# EAGLE schematic NSE2022_GPSDOWNLINK_ver0 (EAGLE 9.6.0)
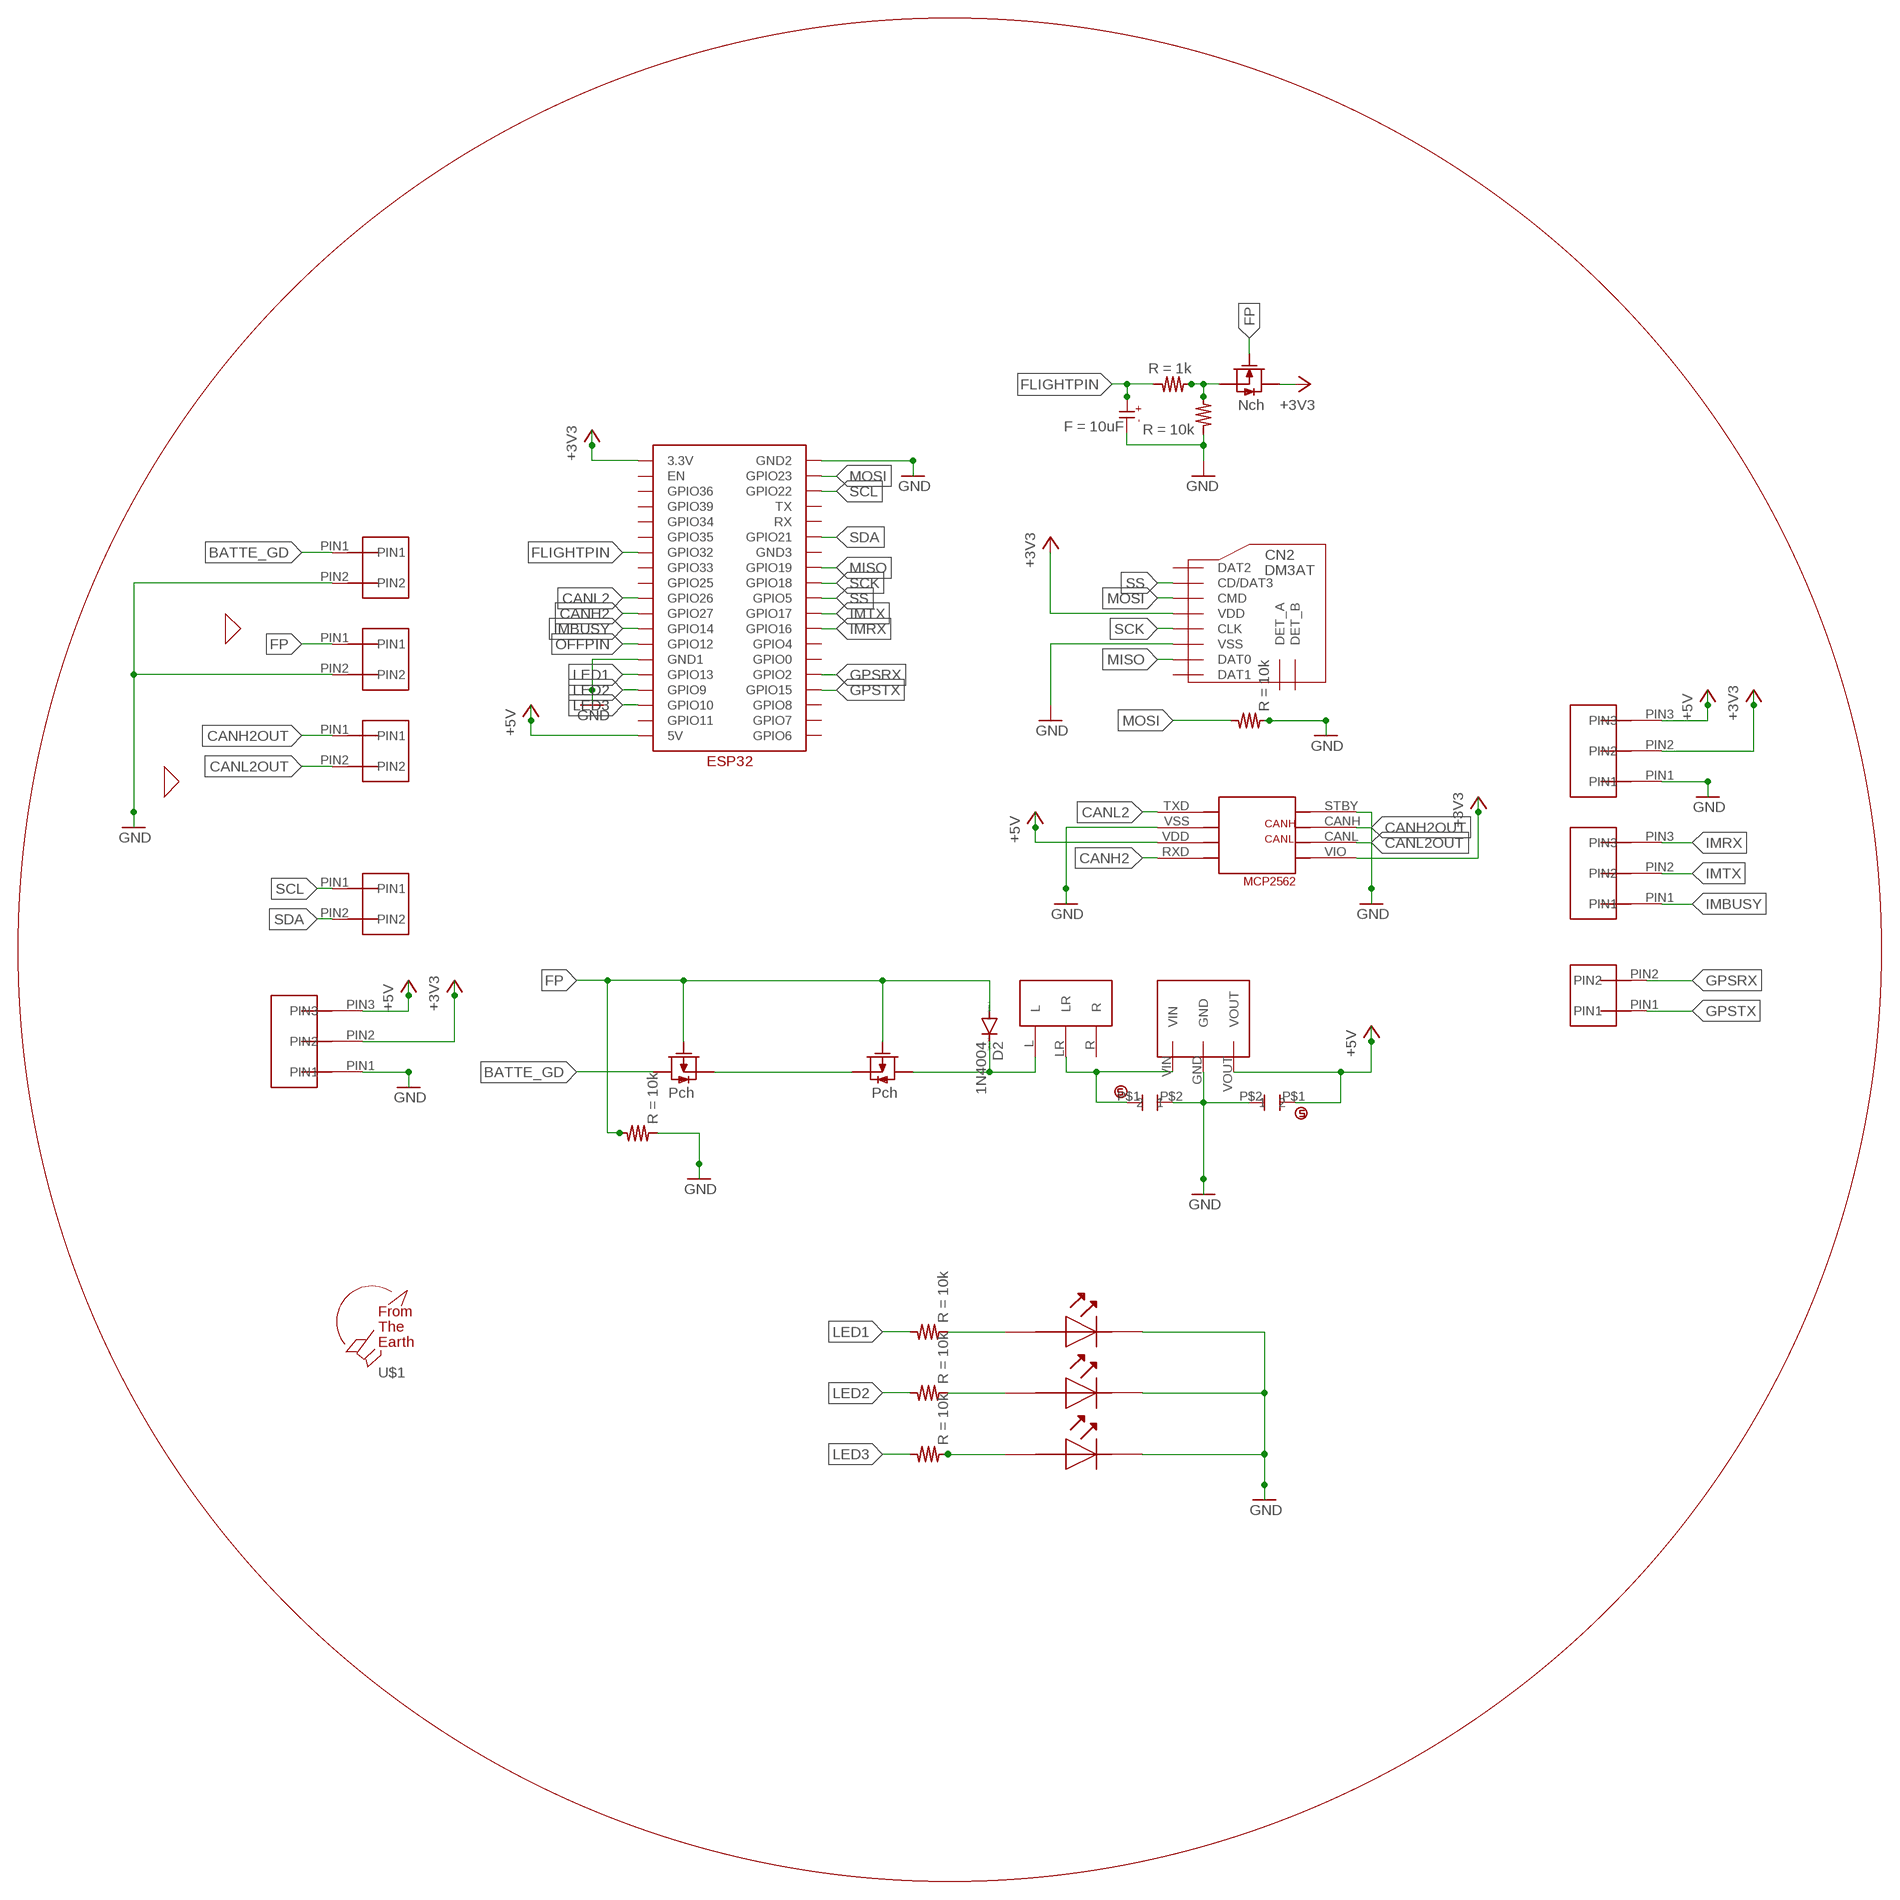
[diagram p0: schematic, sheet 1]

## Parts
10K  10K  RESISTER  [REGISTER]
C3  CAPACITOR-ELECTROLYTIC_1  [CAPACITOR-ELECTROLYTIC_1]
CERAMIC_CAPACITOR1  CERAMIC_CAPACITOR  [CERAMIC_CAPACITOR]
CERAMIC_CAPACITOR2  CERAMIC_CAPACITOR  [CERAMIC_CAPACITOR]
CN2  DM3AT  [DM3AT]
D2  1N4004  [DO41-10]
R1  RESISTER  [REGISTER]
R2  RESISTER  [REGISTER]
R3  RESISTER  [REGISTER]
R7  RESISTER  [REGISTER]
R8  RESISTER  [REGISTER]
R16  RESISTER  [REGISTER]
SRIDE_SWTCH3  SRIDE_SWITCH  [SRIDE_SWITCH]
U$1  F.T.E.LOGO  [LOGO]
U$2  2PIN  [2PIN]
U$3  2SJ681-PCH  [2SJ681]
U$4  3PIN  [3PIN]
U$5  2SJ681-PCH  [2SJ681]
U$6  M78AR05-1  [M78AR05-1]
U$7  2SK4017-NCH  [2SK4017]
U$22  2PIN  [2PIN]
U$23  2PIN  [2PIN]
U$24  2PIN  [2PIN]
U$26  ESP32  [ESP32]
U$28  MCP2562  [MCP2562]
U$29  2PIN  [2PIN]
U$46  3PIN  [3PIN]
U$49  3PIN  [3PIN]
U$55  LED  [LED]
U$70  LED  [LED]
U$71  LED  [LED]

## Nets
+3V3: CN2.VDD U$4.PIN2 U$7.DRAIN U$26.3.3V U$28.VIO U$46.PIN2
+5V: CERAMIC_CAPACITOR1.P$1 U$4.PIN3 U$6.VOUT U$26.5V U$28.VDD U$46.PIN3
BATTE_GD: U$5.DRAIN U$22.PIN1
CANH2: U$26.GPIO27 U$28.RXD
CANH2OUT: U$24.PIN1 U$28.CANH
CANL2: U$26.GPIO26 U$28.TXD
CANL2OUT: U$24.PIN2 U$28.CANL
FLIGHTPIN: C3.KS R8.A U$26.GPIO32
FP: D2.A R3.B U$3.GATE U$5.GATE U$7.GATE U$23.PIN1
GND: 10K.A C3.AN CERAMIC_CAPACITOR1.P$2 CERAMIC_CAPACITOR2.P$2 CN2.VSS R3.A R7.A U$4.PIN1 U$6.GND U$22.PIN2 U$23.PIN2 U$26.GND1 U$28.STBY U$28.VSS U$46.PIN1 U$55.PLUS(OUT) U$70.PLUS(OUT) U$71.PLUS(OUT)
GPSRX: U$26.GPIO2 U$29.PIN2
GPSTX: U$26.GPIO15 U$29.PIN1
IMBUSY: U$26.GPIO14 U$49.PIN1
IMRX: U$26.GPIO16 U$49.PIN3
IMTX: U$26.GPIO17 U$49.PIN2
LED1: R1.B U$26.GPIO13
LED2: R2.B U$26.GPIO9
LED3: R16.B U$26.GPIO10
MISO: CN2.DAT0 U$26.GPIO19
MOSI: 10K.B CN2.CMD U$26.GPIO23
N$1: U$26.GND2 ; supply symbol labelled GND
N$3: U$3.SOURCE U$5.SOURCE
N$4: CERAMIC_CAPACITOR2.P$1 SRIDE_SWTCH3.LR U$6.VIN
N$9: R7.B R8.B U$7.SOURCE
N$12: D2.C SRIDE_SWTCH3.L U$3.DRAIN
N$14: R1.A U$55.MINUS(IN)
N$18: R2.A U$70.MINUS(IN)
N$19: R16.A U$71.MINUS(IN)
OFFPIN: U$26.GPIO12
SCK: CN2.CLK U$26.GPIO18
SCL: U$2.PIN1 U$26.GPIO22
SDA: U$2.PIN2 U$26.GPIO21
SS: CN2.CD/DAT3 U$26.GPIO5
Unconnected: CN2.DAT1 CN2.DAT2 CN2.DET_A CN2.DET_B SRIDE_SWTCH3.R U$26.EN U$26.GND3 U$26.GPIO0 U$26.GPIO4 U$26.GPIO6 U$26.GPIO7 U$26.GPIO8 U$26.GPIO11 U$26.GPIO25 U$26.GPIO33 U$26.GPIO34 U$26.GPIO35 U$26.GPIO36 U$26.GPIO39 U$26.RX U$26.TX

## Library data of the parts
10K R1-R3 R7 R16 = normal register:RESISTER; R: 10k
C3 = normal capacitor:CAPACITOR-ELECTROLYTIC_1; F: 10uF
CERAMIC_CAPACITOR1 CERAMIC_CAPACITOR2 = capacitor:CERAMIC_CAPACITOR: ceramic_capacitor
CN2 = microSD:DM3AT
D2 = diode:1N4004: DIODE general purpose rectifier, 1 A
R8 = normal register:RESISTER; R: 1k
SRIDE_SWTCH3 = Switches:SRIDE_SWITCH
U$1 = logo:F.T.E.LOGO
U$2 U$22-U$24 U$29 = 2PIN:2PIN
U$3 U$5 = MOSFET:2SJ681-PCH
U$4 U$46 U$49 = 3PIN:3PIN
U$6 = M78AR05-1:M78AR05-1
U$7 = MOSFET:2SK4017-NCH
U$26 = ESP32:ESP32
U$28 = MCP2562:MCP2562
U$55 U$70 U$71 = LEDkato:LED